# EAGLE design pcie_board (EAGLE 6.1)

## Sheet 1 of 2
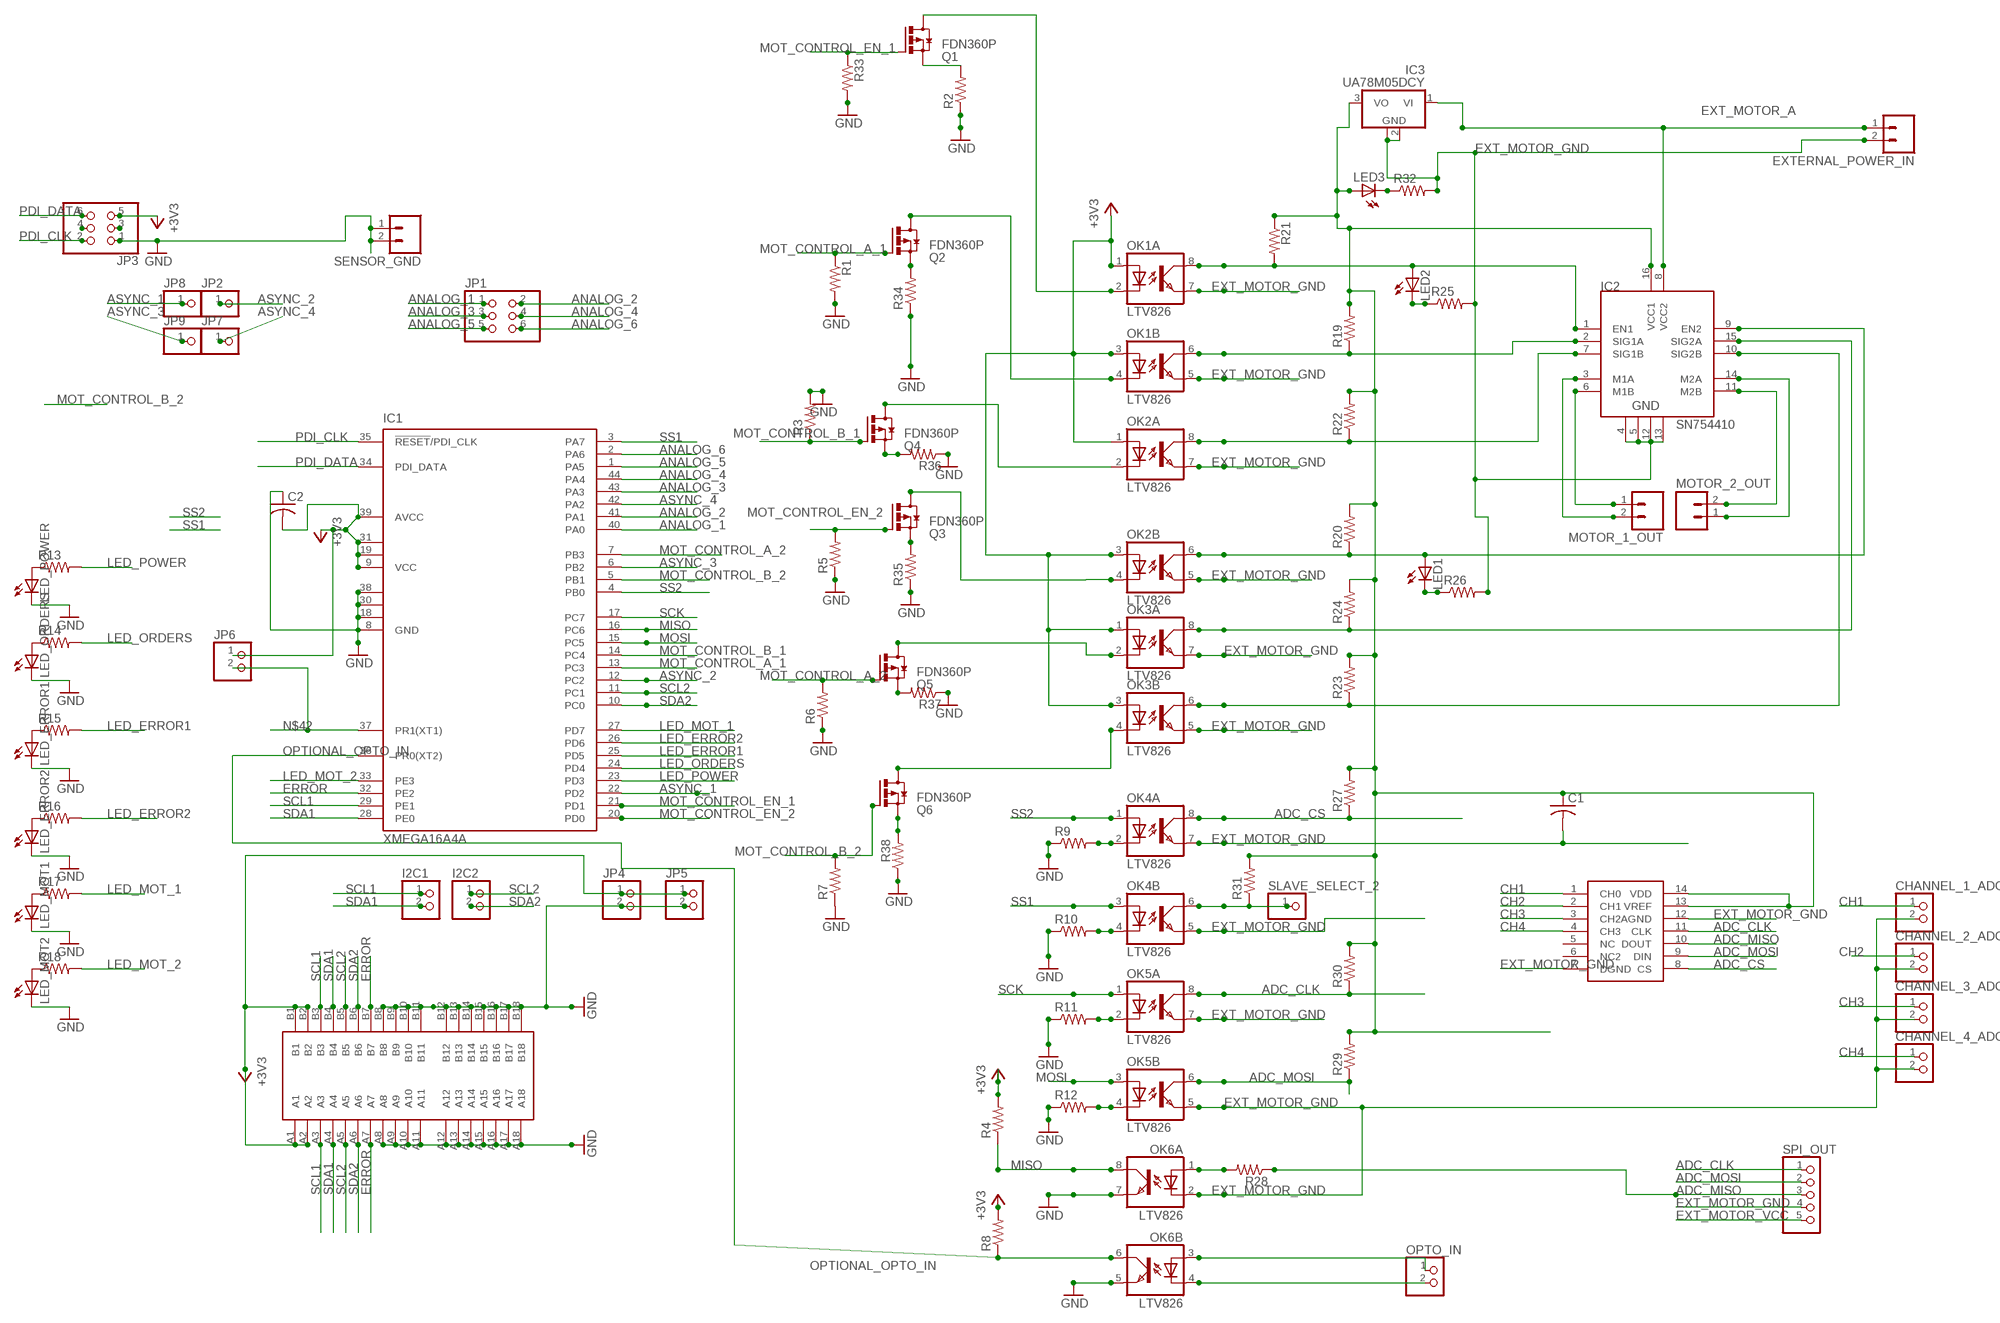
[diagram p0: schematic, sheet 1]

### Parts
C1  C-US025-040X050  [C025-040X050]
C2  C-US025-040X050  [C025-040X050]
CHANNEL_1_ADC  PINHD-1X2  [1X02]
CHANNEL_2_ADC  PINHD-1X2  [1X02]
CHANNEL_3_ADC  PINHD-1X2  [1X02]
CHANNEL_4_ADC  PINHD-1X2  [1X02]
EXTERNAL_POWER_IN  M023.5MM  [SCREWTERMINAL-3.5MM-2]
I2C1  PINHD-1X2  [1X02]
I2C2  PINHD-1X2  [1X02]
IC1  XMEGA16A4A  [TQFP44]
IC2  SN754410  [DIP16]
IC3  UA78M05DCY  [SOT223]
JP1  PINHD-2X3  [2X03]
JP2  PINHD-1X1  [1X01]
JP3  PINHD-2X3  [2X03]
JP4  PINHD-1X2  [1X02]
JP5  PINHD-1X2  [1X02]
JP6  PINHD-1X2  [1X02]
JP7  PINHD-1X1  [1X01]
JP8  PINHD-1X1  [1X01]
JP9  PINHD-1X1  [1X01]
LED1  LEDCHIP-LED0603  [CHIP-LED0603]
LED2  LEDCHIP-LED0603  [CHIP-LED0603]
LED3  LEDCHIP-LED0603  [CHIP-LED0603]
LED_ERROR1  LED5MM  [LED5MM]
LED_ERROR2  LED5MM  [LED5MM]
LED_MOT1  LED5MM  [LED5MM]
LED_MOT2  LED5MM  [LED5MM]
LED_ORDERS  LED5MM  [LED5MM]
LED_POWER  LED5MM  [LED5MM]
MOTOR_1_OUT  M023.5MM  [SCREWTERMINAL-3.5MM-2]
MOTOR_2_OUT  M023.5MM  [SCREWTERMINAL-3.5MM-2]
OK1  LTV826  [DIL08]
OK2  LTV826  [DIL08]
OK3  LTV826  [DIL08]
OK4  LTV826  [DIL08]
OK5  LTV826  [DIL08]
OK6  LTV826  [DIL08]
OPTO_IN  PINHD-1X2  [1X02]
Q1  FDN360P  [SUPER-SOT3]
Q2  FDN360P  [SUPER-SOT3]
Q3  FDN360P  [SUPER-SOT3]
Q4  FDN360P  [SUPER-SOT3]
Q5  FDN360P  [SUPER-SOT3]
Q6  FDN360P  [SUPER-SOT3]
R1  R-US_M0805  [M0805]
R2  R-US_M0805  [M0805]
R3  R-US_M0805  [M0805]
R4  R-US_M0805  [M0805]
R5  R-US_M0805  [M0805]
R6  R-US_M0805  [M0805]
R7  R-US_M0805  [M0805]
R8  R-US_M0805  [M0805]
R9  R-US_M0805  [M0805]
R10  R-US_M0805  [M0805]
R11  R-US_M0805  [M0805]
R12  R-US_M0805  [M0805]
R13  R-US_M0805  [M0805]
R14  R-US_M0805  [M0805]
R15  R-US_M0805  [M0805]
R16  R-US_M0805  [M0805]
R17  R-US_M0805  [M0805]
R18  R-US_M0805  [M0805]
R19  R-US_M0805  [M0805]
R20  R-US_M0805  [M0805]
R21  R-US_M0805  [M0805]
R22  R-US_M0805  [M0805]
R23  R-US_M0805  [M0805]
R24  R-US_M0805  [M0805]
R25  R-US_M0805  [M0805]
R26  R-US_M0805  [M0805]
R27  R-US_M0805  [M0805]
R28  R-US_M0805  [M0805]
R29  R-US_M0805  [M0805]
R30  R-US_M0805  [M0805]
R31  R-US_M0805  [M0805]
R32  R-US_M0805  [M0805]
R33  R-US_M0805  [M0805]
R34  R-US_M0805  [M0805]
R35  R-US_M0805  [M0805]
R36  R-US_M0805  [M0805]
R37  R-US_M0805  [M0805]
R38  R-US_M0805  [M0805]
SENSOR_GND  M023.5MM  [SCREWTERMINAL-3.5MM-2]
SLAVE_SELECT_2  PINHD-1X1  [1X01]
SPI_OUT  PINHD-1X5  [1X05]
U$1  PCI-E1X_EDGE  [PCI-E_X1_EDGE]
U$2  MCP3004  [DIL14]

### Nets
+3V3: C2.2 IC1.9(VCC) IC1.19(VCC1) IC1.31(VCC2) IC1.39(AVCC) JP3.5 JP4.1 JP5.1 JP6.1 OK1.1(A:A) OK1.3(B:A) OK2.1(A:A) OK2.3(B:A) OK3.1(A:A) OK3.3(B:A) R4.2 R8.2 U$1.A1 U$1.A2 U$1.B1 U$1.B2
ADC_CLK: OK5.8(A:COL) R30.1 SPI_OUT.1 U$2.11(CLK)
ADC_CS: OK4.8(A:COL) R27.1 U$2.8(CS)
ADC_MISO: R28.1 SPI_OUT.3 U$2.10(DOUT)
ADC_MOSI: OK5.6(B:COL) R29.1 SPI_OUT.2 U$2.9(DIN)
ANALOG_1: IC1.40(PA0) JP1.1
ANALOG_2: IC1.41(PA1) JP1.2
ANALOG_3: IC1.43(PA3) JP1.3
ANALOG_4: IC1.44(PA4) JP1.4
ANALOG_5: IC1.1(PA5) JP1.5
ANALOG_6: IC1.2(PA6) JP1.6
ASYNC_1: IC1.22(PD2) JP8.1
ASYNC_2: IC1.12(PC2) JP2.1
ASYNC_3: IC1.6(PB2) JP9.1
ASYNC_4: IC1.42(PA2) JP7.1
CH1: CHANNEL_1_ADC.1 U$2.1(CH0)
CH2: CHANNEL_2_ADC.1 U$2.2(CH1)
CH3: CHANNEL_3_ADC.1 U$2.3(CH2)
CH4: CHANNEL_4_ADC.1 U$2.4(CH3)
ERROR: IC1.32(PE2) U$1.A7 U$1.B7
EXT_MOTOR_A [POWER]: EXTERNAL_POWER_IN.1 IC2.8(VCC2) IC3.1(VI)
EXT_MOTOR_GND [clearance]: C1.2 CHANNEL_1_ADC.2 CHANNEL_2_ADC.2 CHANNEL_3_ADC.2 CHANNEL_4_ADC.2 EXTERNAL_POWER_IN.2 IC2.4 IC2.5 IC2.12 IC2.13 IC3.2(GND) IC3.4(GND) OK1.5(B:EMIT) OK1.7(A:EMIT) OK2.5(B:EMIT) OK2.7(A:EMIT) OK3.5(B:EMIT) OK3.7(A:EMIT) OK4.5(B:EMIT) OK4.7(A:EMIT) OK5.5(B:EMIT) OK5.7(A:EMIT) OK6.2(A:C) R25.2 R26.2 R32.2 SPI_OUT.4 U$2.7(DGND) U$2.12(AGND)
EXT_MOTOR_VCC: C1.1 IC2.16(VCC1) IC3.3(VO) LED3.A R19.2 R20.2 R21.1 R22.2 R23.2 R24.2 R27.2 R29.2 R30.2 R31.2 SPI_OUT.5 U$2.13(VREF) U$2.14(VDD)
GND: C2.1 IC1.8(GND) IC1.18(GND1) IC1.30(GND2) IC1.38(GND3) JP3.1 JP4.2 JP5.2 LED_ERROR1.K(C) LED_ERROR2.K(C) LED_MOT1.K(C) LED_MOT2.K(C) LED_ORDERS.K(C) LED_POWER.K(C) OK6.5(B:EMIT) OK6.7(A:EMIT) R1.2 R2.1 R3.2 R5.1 R6.1 R7.1 R9.1 R10.1 R11.1 R12.1 R33.2 R34.1 R35.1 R36.1 R37.1 R38.1 SENSOR_GND.1 SENSOR_GND.2 U$1.A8 U$1.A9 U$1.A10 U$1.A11 U$1.A12 U$1.A13 U$1.A14 U$1.A15 U$1.A16 U$1.A17 U$1.A18 U$1.B8 U$1.B9 U$1.B10 U$1.B11 U$1.B12 U$1.B13 U$1.B14 U$1.B15 U$1.B16 U$1.B17 U$1.B18
LED_ERROR1: IC1.25(PD5) R15.2
LED_ERROR2: IC1.26(PD6) R16.2
LED_MOT_1: IC1.27(PD7) R17.2
LED_MOT_2: IC1.33(PE3) R18.2
LED_ORDERS: IC1.24(PD4) R14.2
LED_POWER: IC1.23(PD3) R13.2
MISO: IC1.16(PC6) OK6.8(A:COL) R4.1
MOSI: IC1.15(PC5) OK5.3(B:A)
MOT_CONTROL_A_1: IC1.13(PC3) Q2.1(G) R1.1
MOT_CONTROL_A_2: IC1.7(PB3) Q5.1(G) R6.2
MOT_CONTROL_B_1: IC1.14(PC4) Q4.1(G) R3.1
MOT_CONTROL_B_2: IC1.5(PB1) Q6.1(G) R7.2
MOT_CONTROL_EN_1: IC1.21(PD1) Q1.1(G) R33.1
MOT_CONTROL_EN_2: IC1.20(PD0) Q3.1(G) R5.2
N$1: IC2.14(M2A) MOTOR_2_OUT.1
N$2: Q1.2(S) R2.2
N$3: IC2.11(M2B) MOTOR_2_OUT.2
N$4: OK1.2(A:C) Q1.3(D)
N$5: Q2.2(S) R34.2
N$6: OK1.4(B:C) Q2.3(D)
N$7: Q4.2(S) R36.2
N$8: OK4.2(A:C) R9.2
N$9: OK2.4(B:C) Q3.3(D)
N$10: OK3.2(A:C) Q5.3(D)
N$11: Q5.2(S) R37.2
N$12: OK4.4(B:C) R10.2
N$13: OK5.2(A:C) R11.2
N$14: OK5.4(B:C) R12.2
N$15: Q3.2(S) R35.2
N$16: LED_POWER.A R13.1
N$17: LED_ORDERS.A R14.1
N$18: OK2.2(A:C) Q4.3(D)
N$19: OK4.6(B:COL) R31.1 SLAVE_SELECT_2.1
N$20: LED_ERROR1.A R15.1
N$21: LED_ERROR2.A R16.1
N$22: LED_MOT1.A R17.1
N$23: LED_MOT2.A R18.1
N$24: IC2.1(EN1) LED2.A OK1.8(A:COL) R21.2
N$25: IC2.2(SIG1A) OK1.6(B:COL) R19.1
N$26: LED2.C R25.1
N$27: LED1.C R26.1
N$28: IC2.9(EN2) LED1.A OK2.6(B:COL) R20.1
N$29: IC2.7(SIG1B) OK2.8(A:COL) R22.1
N$30: IC2.15(SIG2A) OK3.8(A:COL) R24.1
N$31 [POWER]: IC2.3(M1A) MOTOR_1_OUT.2
N$32 [POWER]: IC2.6(M1B) MOTOR_1_OUT.1
N$33: IC2.10(SIG2B) OK3.6(B:COL) R23.1
N$34: OK6.1(A:A) R28.2
N$35: OK6.3(B:A) OPTO_IN.1
N$36: OK6.4(B:C) OPTO_IN.2
N$37: LED3.C R32.1
N$38: Q6.2(S) R38.2
N$39: JP3.4
N$40: JP3.3
N$41: OK3.4(B:C) Q6.3(D)
N$42: IC1.37(PR1(XT1)) JP6.2
OPTIONAL_OPTO_IN: IC1.36(PR0(XT2)) OK6.6(B:COL) R8.1
PDI_CLK: IC1.35(!RESET!/PDI_CLK) JP3.2
PDI_DATA: IC1.34(PDI_DATA) JP3.6
SCK: IC1.17(PC7) OK5.1(A:A)
SCL1: I2C1.1 IC1.29(PE1) U$1.A3 U$1.B3
SCL2: I2C2.1 IC1.11(PC1) U$1.A5 U$1.B5
SDA1: I2C1.2 IC1.28(PE0) U$1.A4 U$1.B4
SDA2: I2C2.2 IC1.10(PC0) U$1.A6 U$1.B6
SS1: IC1.3(PA7) OK4.3(B:A)
SS2: IC1.4(PB0) OK4.1(A:A)
Unconnected: U$2.5(NC) U$2.6(NC2)

## Sheet 2 of 2

## Library data of the parts
C1 C2 = resistor:C-US: CAPACITOR, American symbol
CHANNEL_1_ADC CHANNEL_2_ADC CHANNEL_3_ADC CHANNEL_4_ADC I2C1 I2C2 JP4-JP6 OPTO_IN = pinhead:PINHD-1X2: PIN HEADER
EXTERNAL_POWER_IN MOTOR_1_OUT MOTOR_2_OUT SENSOR_GND = SparkFun:M02: Header 2 Standard 2-pin 0.1" header. Use with straight break away headers (SKU : PRT-00116), right angle break away headers (PRT-00553), swiss pins (PRT-00743), machine pins (PRT-00117), and female headers (PRT-00115). Molex polarized connector foot print use with SKU : PRT-08233 with associated crimp pins and housings.
IC1 = atmel:XMEGA16A4: MICROCONTROLLER Features High-performance, Low-power 8/16-bit AVR XMEGA Microcontroller Non-Volatile Program and Data Memories - 16 KB - 128 KB of In-System Self-Programmable Flash - 4 KB - 8 KB Boot Code Section with Independent Lock Bits - 1 KB - 2 KB EEPROM - 2 KB - 8 KB Internal SRAM Peripheral Features - Four-channel DMA Controller with support for external requests - Eight-channel Event System - Five 16-bit Timer/Counters Three Timer/Counters with 4 Output Compare or Input Capture channels Two Timer/Counters with 2 Output Compare or Input Capture channels High-Resolution Extensions on all Timer/Counters Advanced Waveform Extension on one Timer/Counter - Five USARTs IrDA Extension on one USART - Two Two-Wire Interfaces with dual address match (I2C and SMBus compatible) - Two SPIs (Serial Peripheral Interfaces) peripherals - AES and DES Crypto Engine - 16-bit Real Time Counter with Separate Oscillator - One Twelve-channel, 12-bit, 2 Msps Analog to Digital Converter - One Two-channel, 12-bit, 1 Msps Digital to Analog Converter - Two Analog Comparators with Window compare function - External Interrupts on all General Purpose I/O pins - Programmable Watchdog Timer with Separate On-chip Ultra Low Power Oscillator Special Microcontroller Features - Power-on Reset and Programmable Brown-out Detection - Internal and External Clock Options with PLL - Programmable Multi-level Interrupt Controller - Sleep Modes: Idle, Power-down, Standby, Power-save, Extended Standby - Advanced Programming, Test and Debugging Interfaces PDI (Program and Debug Interface) for programming, test and debugging I/O and Packages - 34 Programmable I/O Lines - 44 - lead TQFP - 44 - pad VQFN/QFN - 49 - ball VFBGA Operating Voltage - 1.6 - 3.6V Speed performance - 0 - 12 MHz @ 1.6 - 3.6V - 0 - 32 MHz @ 2.7 - 3.6V Drawn by Dipl.-Ing. (FH) Robert Siegler Created: 27.05.09; OC_FARNELL: unknown; OC_NEWARK: unknown
IC2 = HBridge:SN754410: Quadruple half-H driver
IC3 = linear:UA78M*: POSITIVE-VOLTAGE REGULATORS Source: http://focus.ti.com/lit/ds/symlink/ua78m33.pdf
JP1 JP3 = pinhead:PINHD-2X3: PIN HEADER
JP2 JP7-JP9 SLAVE_SELECT_2 = pinhead:PINHD-1X1: PIN HEADER
LED1-LED3 LED_ERROR1 LED_ERROR2 LED_MOT1 LED_MOT2 LED_ORDERS LED_POWER = led:LED: LED OSRAM: - CHIPLED LG R971, LG N971, LY N971, LG Q971, LY Q971, LO R971, LY R971 LH N974, LH R974 LS Q976, LO Q976, LY Q976 LO Q996 - Hyper CHIPLED LW Q18S LB Q993, LB Q99A, LB R99A - SideLED LS A670, LO A670, LY A670, LG A670, LP A670 LB A673, LV A673, LT A673, LW A673 LH A674 LY A675 LS A676, LA A676, LO A676, LY A676, LW A676 LS A679, LY A679, LG A679 - Hyper Micro SIDELED® LS Y876, LA Y876, LO Y876, LY Y876 LT Y87S - SmartLED LW L88C, LW L88S LB L89C, LB L89S, LG L890 LS L89K, LO L89K, LY L89K LS L896, LA L896, LO L896, LY L896 - TOPLED LS T670, LO T670, LY T670, LG T670, LP T670 LSG T670, LSP T670, LSY T670, LOP T670, LYG T670 LG T671, LOG T671, LSG T671 LB T673, LV T673, LT T673, LW T673 LH T674 LS T676, LA T676, LO T676, LY T676, LB T676, LH T676, LSB T676, LW T676 LB T67C, LV T67C, LT T67C, LS T67K, LO T67K, LY T67K, LW E67C LS E67B, LA E67B, LO E67B, LY E67B, LB E67C, LV E67C, LT E67C LW T67C LS T679, LY T679, LG T679 LS T770, LO T770, LY T770, LG T770, LP T770 LB T773, LV T773, LT T773, LW T773 LH T774 LS E675, LA E675, LY E675, LS T675 LS T776, LA T776, LO T776, LY T776, LB T776 LHGB T686 LT T68C, LB T68C - Hyper Mini TOPLED® LB M676 - Mini TOPLED Santana® LG M470 LS M47K, LO M47K, LY M47K Source: http://www.osram.convergy.de LUXEON: - LUMILED® LXK2-PW12-R00, LXK2-PW12-S00, LXK2-PW14-U00, LXK2-PW14-V00 LXK2-PM12-R00, LXK2-PM12-S00, LXK2-PM14-U00 LXK2-PE12-Q00, LXK2-PE12-R00, LXK2-PE12-S00, LXK2-PE14-T00, LXK2-PE14-U00 LXK2-PB12-K00, LXK2-PB12-L00, LXK2-PB12-M00, LXK2-PB14-N00, LXK2-PB14-P00, LXK2-PB14-Q00 LXK2-PR12-L00, LXK2-PR12-M00, LXK2-PR14-Q00, LXK2-PR14-R00 LXK2-PD12-Q00, LXK2-PD12-R00, LXK2-PD12-S00 LXK2-PH12-R00, LXK2-PH12-S00 LXK2-PL12-P00, LXK2-PL12-Q00, LXK2-PL12-R00 Source: www.luxeon.com KINGBRIGHT: KA-3528ASYC Source: www.kingbright.com
OK1-OK6 = optocoupler:LTV826: OPTO COUPLER Source: LITEON, LTV816.pdf; OC_FARNELL: unknown; OC_NEWARK: unknown
Q1-Q6 = transistor-power:FDN360P: Single P-Channel, PowerTrench (R) MOSFET Source: http://www.fairchildsemi.com/ds/FD/FDN360P.pdf
R1-R38 = resistor:R-US_: RESISTOR, American symbol
SPI_OUT = pinhead:PINHD-1X5: PIN HEADER
U$1 = con-pci_express(pci-e):PCI-E1X_EDGE
U$2 = microchip:MCP3004

## Net classes
0 default: width 0.203 mm, clearance 0.203 mm
1 POWER: width 0.813 mm, clearance 0.203 mm
2 clearance: width 0.203 mm, clearance 0.203 mm

## Board
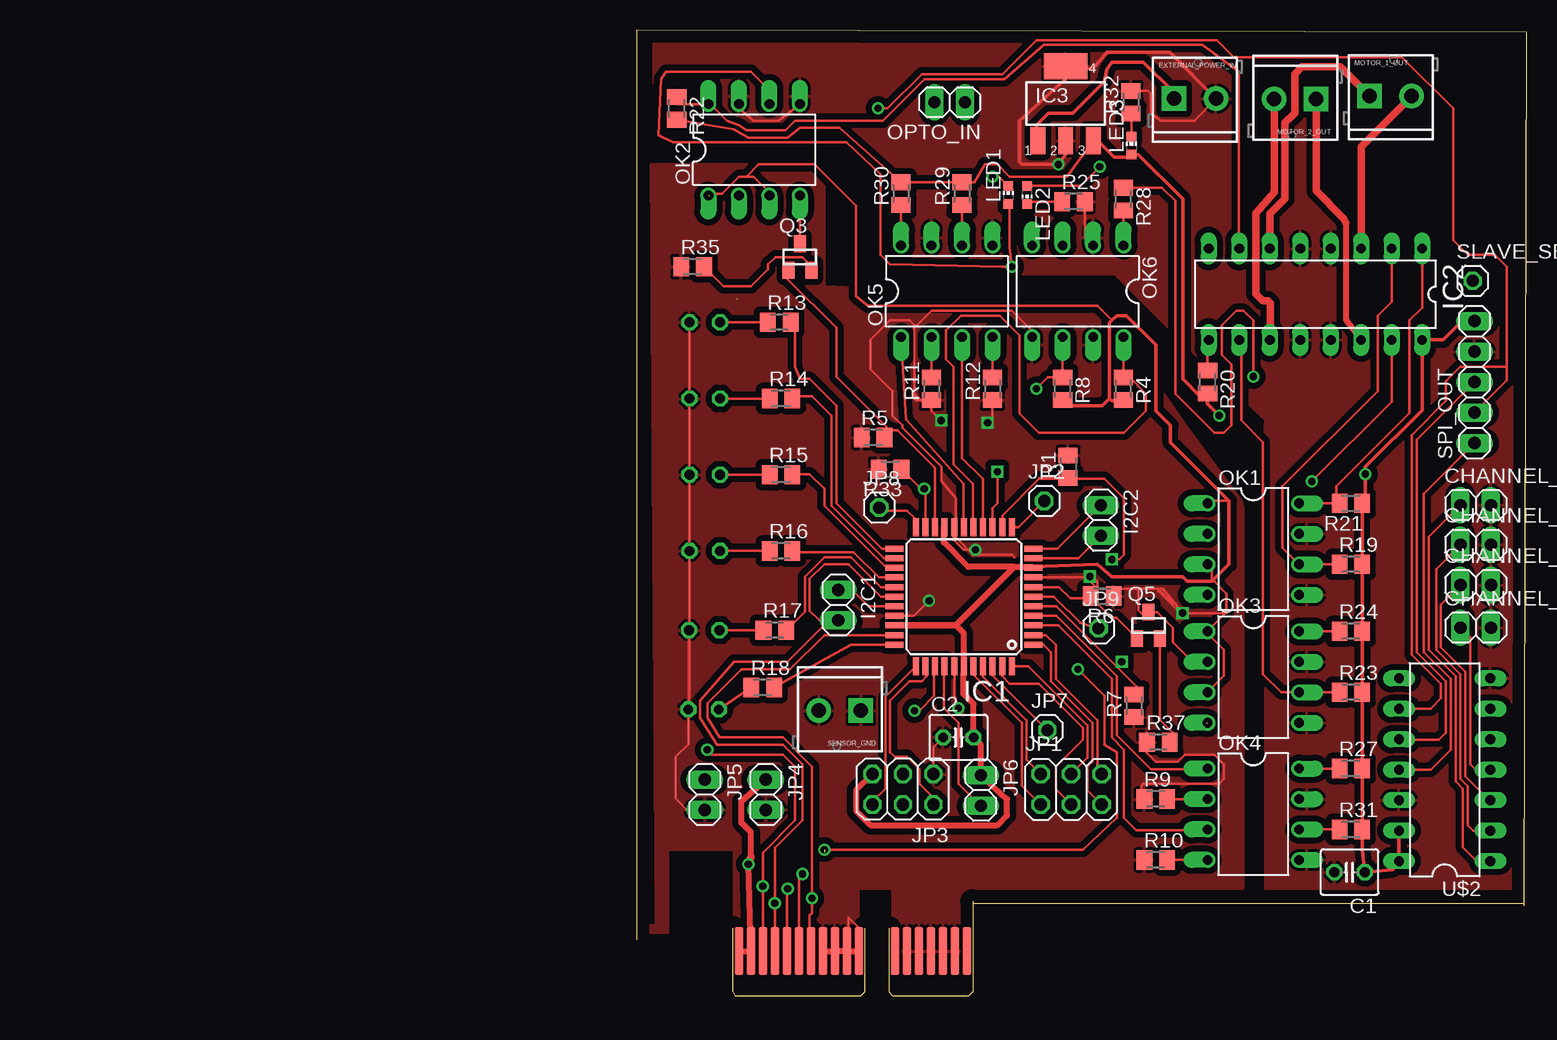
[diagram p1: board, top side]
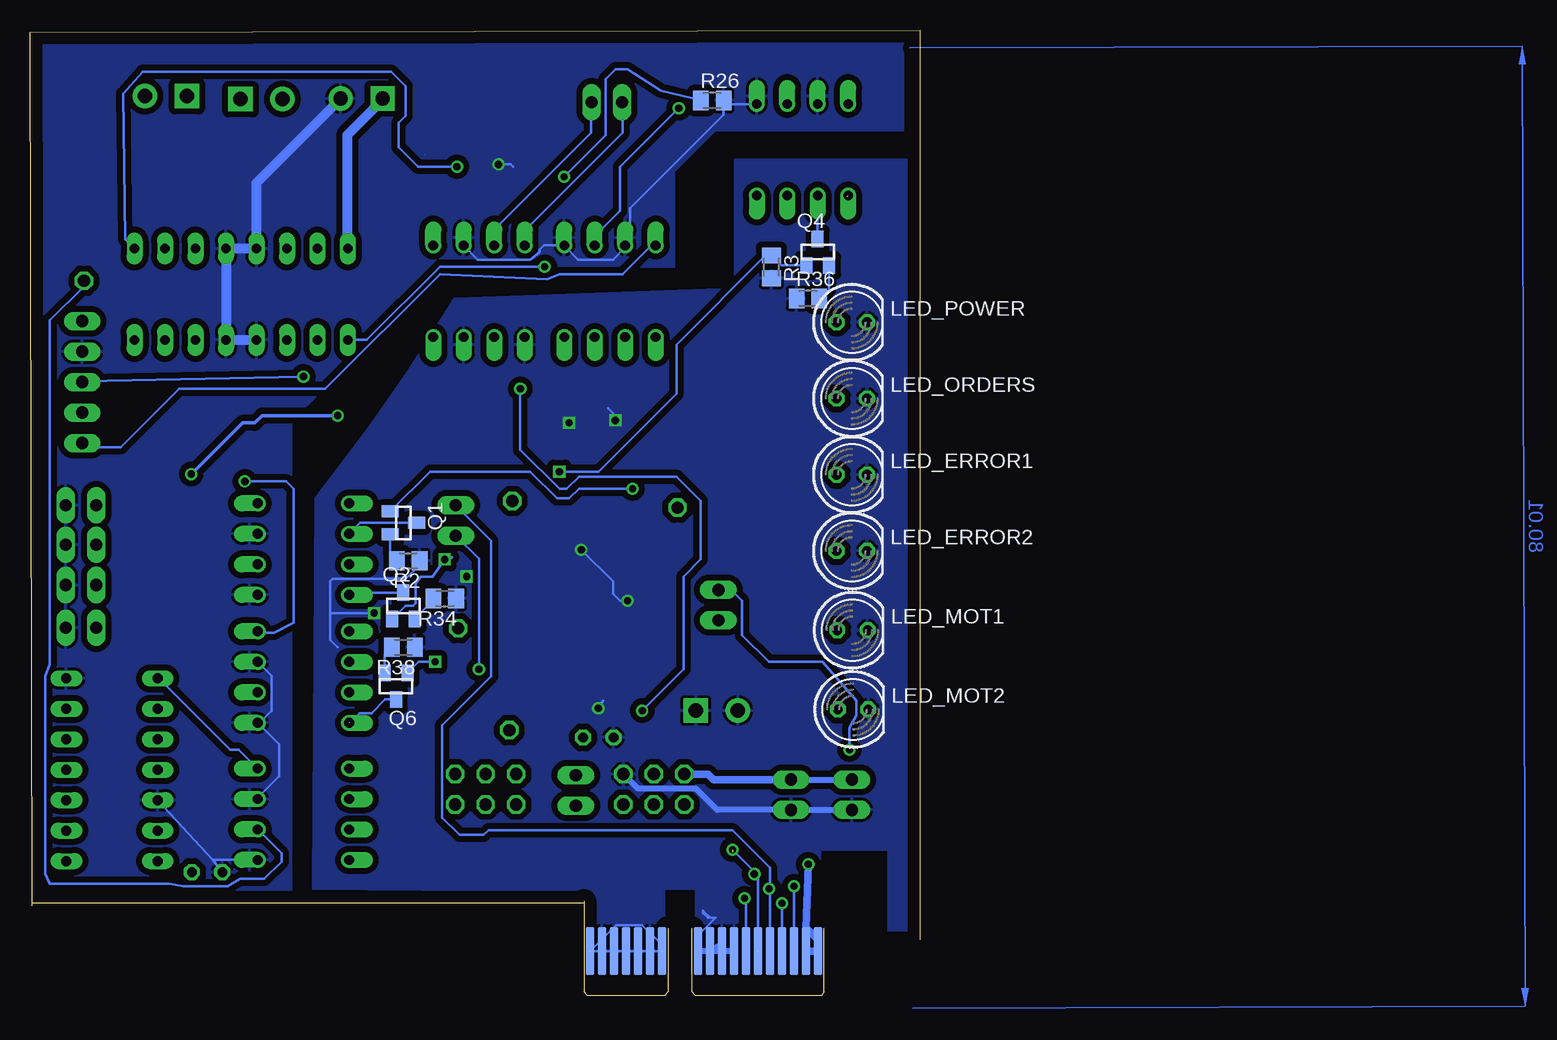
[diagram p2: board, bottom side, seen from below]

Size 74.2 x 80.46 mm. Coordinates in mm from the lower left corner, seen from the top.
Outline: 74,7.48 74.2,80.26 0,80.46 0,4.64
Outline: 28.04,7.69 73.96,7.69
Copper layers (1*16): Top 0.035mm / dielectric 1.5mm / Bottom 0.035mm
Design rules: minimum track width 8mil, minimum drill 24mil, track to track 8mil, track to pad 8mil, pad to pad 8mil, via to via 8mil, smd to smd 8mil, copper to edge 40mil, drill to drill 8mil, minimum pad ring 10mil, minimum via ring 8mil, stop-mask expansion 4mil, vias tented up to drill 0mil, thermal gap 10mil

### Footprints (pad centres in the part's own frame; a part is rotated, then mirrored left to right if it is on the bottom)
C025-040X050 = drill 0.813 octagon: 1 -1.27,0; 2 1.27,0
1X02 = drill 1.016 long: 1 -1.27,0; 2 1.27,0
SCREWTERMINAL-3.5MM-2 = drill 1.2 pad 2.032 square: 1 0,0 | drill 1.2 pad 2.032: 2 3.5,0
TQFP44 = smd 1.5 x 0.5: 1 -5.8,4; 2 -5.8,3.2; 3 -5.8,2.4; 4 -5.8,1.6; 5 -5.8,0.8; 6 -5.8,0; 7 -5.8,-0.8; 8 -5.8,-1.6; 9 -5.8,-2.4; 10 -5.8,-3.2; 11 -5.8,-4; 23 5.8,-4; 24 5.8,-3.2; 25 5.8,-2.4; 26 5.8,-1.6; 27 5.8,-0.8; 28 5.8,0; 29 5.8,0.8; 30 5.8,1.6; 31 5.8,2.4; 32 5.8,3.2; 33 5.8,4 | smd 0.5 x 1.5: 12 -4,-5.8; 13 -3.2,-5.8; 14 -2.4,-5.8; 15 -1.6,-5.8; 16 -0.8,-5.8; 17 0,-5.8; 18 0.8,-5.8; 19 1.6,-5.8; 20 2.4,-5.8; 21 3.2,-5.8; 22 4,-5.8; 34 4,5.8; 35 3.2,5.8; 36 2.4,5.8; 37 1.6,5.8; 38 0.8,5.8; 39 0,5.8; 40 -0.8,5.8; 41 -1.6,5.8; 42 -2.4,5.8; 43 -3.2,5.8; 44 -4,5.8
DIP16 = drill 0.813 long: 1 -10.16,-3.81; 2 -7.62,-3.81; 3 -5.08,-3.81; 4 -2.54,-3.81; 5 0,-3.81; 6 2.54,-3.81; 7 5.08,-3.81; 8 7.62,-3.81; 9 7.62,3.81; 10 5.08,3.81; 11 2.54,3.81; 12 0,3.81; 13 -2.54,3.81; 14 -5.08,3.81; 15 -7.62,3.81; 16 -10.16,3.81
SOT223 = smd 1.219 x 2.235: 1 -2.311,-3.099; 2 0,-3.099; 3 2.311,-3.099 | smd 3.6 x 2.2: 4 0,3.099
2X03 = drill 1.016 octagon: 1 -2.54,-1.27; 2 -2.54,1.27; 3 0,-1.27; 4 0,1.27; 5 2.54,-1.27; 6 2.54,1.27
1X01 = drill 1.016 octagon: 1 0,0
CHIP-LED0603 = smd 0.8 x 0.8: A 0,-0.75; C 0,0.75
LED5MM = drill 0.813 octagon: A -1.27,0; K 1.27,0
DIL08 = drill 0.813 offset: 1 -3.81,-3.81; 2 -1.27,-3.81; 3 1.27,-3.81; 4 3.81,-3.81; 5 3.81,3.81; 6 1.27,3.81; 7 -1.27,3.81; 8 -3.81,3.81
SUPER-SOT3 = smd 1 x 1.4: 1 -0.95,-1.1; 2 0.95,-1.1; 3 0,1.1
M0805 = smd 1.3 x 1.6: 1 -0.95,0; 2 0.95,0
1X05 = drill 1.016 long: 1 -5.08,0; 2 -2.54,0; 3 0,0; 4 2.54,0; 5 5.08,0
PCI-E_X1_EDGE = smd 0.7 x 4 bottom: A1 -11.14,-1.6; A2 -10.14,-1.6; A3 -9.14,-1.6; A4 -8.14,-1.6; A5 -7.14,-1.6; A6 -6.14,-1.6; A7 -5.14,-1.6; A8 -4.14,-1.6; A9 -3.14,-1.6; A10 -2.14,-1.6; A11 -1.14,-1.6; A12 1.86,-1.6; A13 2.86,-1.6; A14 3.86,-1.6; A15 4.86,-1.6; A16 5.86,-1.6; A17 6.86,-1.6; A18 7.86,-1.6 | smd 0.7 x 4: B1 -11.14,-1.6; B2 -10.14,-1.6; B3 -9.14,-1.6; B4 -8.14,-1.6; B5 -7.14,-1.6; B6 -6.14,-1.6; B7 -5.14,-1.6; B8 -4.14,-1.6; B9 -3.14,-1.6; B10 -2.14,-1.6; B11 -1.14,-1.6; B12 1.86,-1.6; B13 2.86,-1.6; B14 3.86,-1.6; B15 4.86,-1.6; B16 5.86,-1.6; B17 6.86,-1.6; B18 7.86,-1.6
DIL14 = drill 0.813 long: 1 -7.62,-3.81; 2 -5.08,-3.81; 3 -2.54,-3.81; 4 0,-3.81; 5 2.54,-3.81; 6 5.08,-3.81; 7 7.62,-3.81; 8 7.62,3.81; 9 5.08,3.81; 10 2.54,3.81; 11 0,3.81; 12 -2.54,3.81; 13 -5.08,3.81; 14 -7.62,3.81

### Placement (x,y rotation side)
C1  59.44,10.28 180 top
C2  26.82,21.51 0 top
CHANNEL_1_ADC  69.95,40.86 0 top
CHANNEL_2_ADC  69.95,37.56 0 top
CHANNEL_3_ADC  69.95,34.21 0 top
CHANNEL_4_ADC  69.95,30.65 0 top
EXTERNAL_POWER_IN  44.81,74.74 0 top
I2C1  16.81,32.53 270 top
I2C2  38.71,39.59 270 top
IC1  27.28,33.24 180 top
IC2  55.32,58.44 180 top
IC3  35.76,74.34 0 top
JP1  36.22,17.19 0 top
JP2  33.99,41.22 0 top
JP3  22.2,17.19 180 top
JP4  10.77,16.73 270 top
JP5  5.69,16.73 270 top
JP6  28.7,17.09 270 top
JP7  34.24,22.11 0 top
JP8  20.22,40.66 0 top
JP9  38.51,30.6 0 top
LED1  30.99,66.72 0 top
LED2  32.56,66.72 180 top
LED3  41.25,70.83 0 top
LED_ERROR1  5.69,43.4 0 bottom
LED_ERROR2  5.69,37.05 0 bottom
LED_MOT1  5.64,30.45 0 bottom
LED_MOT2  5.59,23.84 0 bottom
LED_ORDERS  5.69,49.75 0 bottom
LED_POWER  5.69,56.1 0 bottom
MOTOR_1_OUT  61.11,74.95 0 top
MOTOR_2_OUT  56.64,74.69 180 top
OK1  51.41,37.2 270 top
OK2  9.8,70.48 0 top
OK3  51.41,26.53 270 top
OK4  51.41,15.1 270 top
OK5  25.86,58.69 0 top
OK6  36.78,58.69 180 top
OPTO_IN  26.11,74.44 180 top
Q1  43.08,39.39 270 bottom
Q2  43.08,32.48 0 bottom
Q3  13.61,61.54 0 top
Q4  8.53,61.94 0 bottom
Q5  42.67,30.85 0 top
Q6  43.69,25.77 180 bottom
R1  35.97,44.06 90 top
R2  42.67,36.24 180 bottom
R3  12.4,60.72 270 bottom
R4  40.59,50.56 270 top
R5  19.71,46.5 0 top
R6  38.81,33.29 180 top
R7  41.45,24.15 90 top
R8  35.51,50.56 270 top
R9  43.28,16.37 0 top
R10  43.28,11.29 0 top
R11  24.59,50.56 90 top
R12  29.67,50.56 90 top
R13  11.89,56.1 0 top
R14  12.04,49.75 0 top
R15  12.04,43.4 0 top
R16  12.04,37.05 0 top
R17  11.53,30.45 0 top
R18  10.52,25.67 0 top
R19  59.54,35.93 0 top
R20  47.6,51.12 270 top
R21  59.54,41.01 180 top
R22  3.35,73.93 270 top
R23  59.54,25.26 0 top
R24  59.54,30.34 0 top
R25  36.42,66.16 0 top
R26  17.32,74.59 0 bottom
R27  59.54,18.91 0 top
R28  40.59,66.36 270 top
R29  27.13,66.82 90 top
R30  22.05,66.82 90 top
R31  59.54,13.83 0 top
R32  41.2,74.44 90 top
R33  21.13,43.86 180 top
R34  39.62,33.09 180 bottom
R35  4.67,60.72 0 top
R36  9.35,58.08 0 bottom
R37  43.48,21.1 0 top
R38  43.08,29.02 180 bottom
SENSOR_GND  18.69,23.74 180 top
SLAVE_SELECT_2  69.7,59.55 0 top
SPI_OUT  69.85,51.12 90 top
U$1  19.66,5.3 0 top
U$2  67.36,18.81 90 top

### Tracks (layer width: path | path; a pad name or v marks a point on that pad's centre or on a via)
+3V3  (via drill 0.6)  (1 unrouted)
  Top 0.203: JP3.5 19.66,18.41 | 27.23,26.78 IC1.39 | 49.38,41.22 47.8,41.22 OK1.1 | OK1.3 47.96,35.58 47.96,34.51 48.16,34.51 49.17,33.49 49.17,31.92 OK3.1 47.6,30.19 48.97,28.82 48.97,26.64 OK3.3 47.85,25.26 | OK2.3 11.07,66.92 9.75,68.24 9.14,68.24 | 39.62,56.25 38.4,57.47 19.3,57.47 18.29,58.28 18.29,65.8 14.83,69.26 10.16,69.26 9.14,68.24 | 9.14,68.24 8.53,68.24 7.11,66.82 6.3,66.82 6.1,66.62
  Top 0.305: 32.99,35.73 38.4,35.93 39.62,34.92 45.52,34.92 45.92,34.51 47.96,34.51 49.38,35.93 49.38,41.22 44.5,46.09 44.5,47.52 43.28,48.73 43.28,54.22 40.84,56.66 40.03,56.66 39.62,56.25 39.42,56.05 39.42,49.75 | 39.42,49.75 39.62,49.55 40.52,49.55 R4.2 | 39.42,49.75 38.81,49.14 35.98,49.14 R8.2
  Top 0.508: U$1.A1 U$1.A2 v9.32,10.94 | 9.52,11.55 9.52,13.61 8.74,14.39 8.74,16.17 JP4.1 | 27.23,26.78 27.23,25.16 28.09,24.3 C2.2 28.7,20.9 JP6.1 30.89,16.37 30.89,15 30.07,14.19 19.51,14.19 18.29,15.41 18.29,17.09 JP3.5 | IC1.39 27.28,30.19 26.62,30.85 21.49,30.85 IC1.31 26.61,30.84 31.5,35.73 | 31.5,35.73 32.99,35.73 IC1.9 | 31.5,35.73 27.64,35.73 25.6,37.76 25.6,38.96 IC1.19
  Top 0.61: v9.32,10.94 9.52,11.55
  Bottom 0.508: JP4.1 JP5.1
  Bottom 0.61: U$1.A2 U$1.A1 8.52,4.66 9.52,5.66 v9.32,10.94 | JP4.1 17.22,18 17.68,18.46 JP3.5
ADC_CLK
  Top 0.203: OK5.8 R30.1 | SPI_OUT.1 65.63,41.83 65.63,28.62 67.87,26.38 67.87,20.49 66.19,18.81 U$2.11
  Bottom 0.203: OK5.8 22.4,62.5 24.79,60.11 30.07,60.11 31.09,59.71 40.03,60.11 49.58,50.56 61.77,50.56 66.65,45.69 69.49,45.69 SPI_OUT.1
ADC_CS
  Top 0.203: R27.1 OK4.8
  Bottom 0.203: U$2.8 63.45,26.43 57.51,20.49 56.79,20.49 OK4.8
ADC_MISO  (via drill 0.6)
  Top 0.203: R28.1 43.8,67.31 44.91,66.21 44.91,50.16 48.16,46.91 48.97,46.91 49.58,47.52 49.58,52.6 48.77,53.41 48.77,55.85 49.99,57.07 50.6,57.07 51.41,56.25 v51.41,51.58 | 64.67,21.35 U$2.10 63.6,21.3 66.85,21.3 67.46,21.91 67.46,26.18 65.02,28.62 65.02,46.3 SPI_OUT.3
  Bottom 0.203: v51.41,51.58 69.8,51.17 SPI_OUT.3
ADC_MOSI  (via drill 0.6)
  Top 0.203: OK5.6 R29.1 | 72.54,52.39 72.54,60.72 71.53,61.74 69.29,61.74 68.07,62.96 68.07,73.93 63.8,78.2 49.78,78.2 48.36,79.62 33.32,79.62 30.48,76.78 23.77,76.78 20.93,73.93 v20.12,73.93 | 72.54,52.39 72.54,51.27 SPI_OUT.2 | U$2.9 66.19,23.89 67.06,24.76 67.06,25.98 64.62,28.41 64.62,46.7 67.46,49.55 67.46,51.17 68.68,52.39 72.54,52.39
  Bottom 0.203: OK5.6 27.13,63.26 24.99,65.4 24.99,69.05 v20.12,73.93
ANALOG_1
  Top 0.203: IC1.40 28.08,26.75 32.11,22.72 32.11,17.49 JP1.1
ANALOG_2
  Top 0.203: IC1.41 28.88,26.56 32.51,22.93 32.51,19.63 JP1.2
ANALOG_3
  Top 0.203: IC1.43 30.48,26.59 31.09,25.98 33.53,25.98 37.19,22.32 37.19,21.3 34.95,19.07 34.95,17.19 JP1.3
ANALOG_4
  Top 0.203: IC1.44 32.67,27.44 37.59,22.52 37.59,19.83 JP1.4
ANALOG_5
  Top 0.203: IC1.1 33.92,29.24 34.54,28.62 34.54,26.18 38,22.72 38,19.47 37.59,19.07 37.59,17.09 JP1.5
ANALOG_6
  Top 0.203: IC1.2 34.14,30.04 34.95,29.23 34.95,26.38 38.4,22.93 38.4,18.81 JP1.6
ASYNC_1
  Top 0.203: IC1.22 23.28,39.68 22.56,40.4 20.47,40.4 JP8.1
ASYNC_2
  Top 0.203: IC1.12 31.81,39.04 JP2.1
ASYNC_3
  Top 0.203: IC1.6 34.8,33.24 36.98,31.06 38.25,30.65 JP9.1
ASYNC_4
  Top 0.203: IC1.42 29.68,26.67 JP7.1
CH1
  Top 0.203: U$2.1 70.05,11.19 68.88,12.36 68.88,17.24 68.28,17.85 68.28,26.59 66.04,28.82 66.04,38.22 CHANNEL_1_ADC.1
CH2
  Top 0.203: U$2.2 69.75,13.73 69.29,14.19 69.29,17.44 68.68,18.05 68.68,26.79 66.65,28.82 66.65,35.53 CHANNEL_2_ADC.1
CH3
  Top 0.203: U$2.3 71.07,16.27 69.09,18.25 69.09,26.99 67.06,29.02 67.06,32.58 CHANNEL_3_ADC.1
CH4
  Top 0.203: U$2.4 69.95,18.81 69.49,19.27 69.49,29.84 CHANNEL_4_ADC.1
ERROR  (via drill 0.6)
  Top 0.203: IC1.32 15.65,30.04 12.8,27.2 8.74,27.2 5.89,24.35 5.89,23.13 6.91,21.5 12.19,21.5 14.63,19.07 v14.63,8.09 14.63,6.88 14.43,6.67 14.43,3.79 U$1.A7
  Bottom 0.203: U$1.A7 14.52,7.98 v14.63,8.09
EXT_MOTOR_A
  Top 0.305: EXTERNAL_POWER_IN.1 44.81,75.25 42.27,77.79 39.62,77.79 39.22,77.18 39.01,76.17 36.37,73.52 34.34,73.52 33.32,72.51 33.32,71.16 IC3.1
  Bottom 0.813: EXTERNAL_POWER_IN.1 44.81,74.64 47.75,71.7 47.75,62.3 IC2.8
EXT_MOTOR_GND  (via drill 0.6)
  Top 0.203: 41.21,75.39 R32.2 42.64,75.39 42.88,75.15 42.88,73.52 43.69,72.92 46.48,72.92 | 46.48,72.92 EXTERNAL_POWER_IN.2 | OK2.7 8.53,73.93 9.75,72.92 11.84,72.92 OK2.5 | 46.48,72.92 46.53,72.92 | R25.2 37.37,63.18 OK6.2
  Top 0.305: EXTERNAL_POWER_IN.2 44.44,78.6 39.22,78.6 38.05,77.23 IC3.4 35.76,76.37 31.9,72.92 31.9,69.46 32.11,69.26 v35.15,69.26 35.76,70.07 IC3.2
  Bottom 0.203: OK2.5 16.07,74.29 R26.2 16.37,73.41 24.18,65.6 24.18,62.91 OK5.7 24.59,62.35 25.6,61.33 28.5,61.33 OK5.5 31.34,62.5 31.7,62.15 31.7,61.94 32.51,61.33 36.88,61.33 OK6.2 | C1.2 58.98,11.29 | 58.98,11.29 U$2.12 | 58.98,11.29 OK4.5 | OK4.7 55.22,16.48 53.44,18.25 53.44,20.95 OK3.5 55.07,22.72 54.05,23.74 54.05,26.64 OK3.7 | v35.15,69.26 34.14,69.26 33.93,69.05
  Bottom 0.813: IC2.12 IC2.13 IC2.4 IC2.5 55.32,67.73 EXTERNAL_POWER_IN.2
  pour Top (isolate 0.508): 1.42,71.09 17.07,71.09 17.07,60.11 39.83,60.11 47.35,52.59 52.43,47.92 52.02,42.43 52.43,42.43 52.43,8.91 73.96,8.91 74.37,80.23 1.42,80.23
  pour Bottom (isolate 0.508): 1.42,80.43 1.42,72.1 17.07,72.1 20.73,68.44 20.52,68.44 20.52,60.72 39.22,60.72 48.16,51.99 52.43,47.92 52.43,8.7 74.17,8.7 74.17,9.11 73.96,9.11 74.17,80.23
EXT_MOTOR_VCC  (via drill 0.6)  (1 unrouted)
  Top 0.203: R22.2 8.06,72.17 9.35,71.49 12.6,71.49 13.61,72.31 16.9,72.31 R30.2 R29.2 28.18,67.77 29.06,69.26 30.07,69.26 31.09,68.24 35.89,68.24 IC3.3
  Top 0.305: IC3.3 38.66,71.03 39.83,69.87 41.05,69.87 LED3.A | LED3.A 41.85,70.08 45.52,66.41 45.52,51.38 46.94,49.95 47.38,49.95 R20.2 47.6,49.29 v48.56,48.33 | 60.76,41.42 60.76,41.28 R21.1 | SPI_OUT.5 69.8,56.25 68.88,56.25 67.26,54.63 IC2.16 65.48,48.79 60.76,44.06 v60.76,43.45 60.76,41.42 | 60.76,41.42 60.49,41.15 R19.2 R24.2 R23.2 R27.2 R31.2 60.49,12.12 C1.1 63.04,10.48 U$2.14 U$2.13
  Bottom 0.305: v48.56,48.33 54.86,48.33 55.47,47.72 56.49,47.72 v60.76,43.45
GND  (via drill 0.6)  (3 unrouted)
  Top 0.203: 4.32,23.13 LED_MOT2.K 4.42,23.94 LED_ERROR2.K LED_ERROR1.K LED_ORDERS.K LED_POWER.K | 4.32,23.13 4.32,20.95 3.25,19.88 3.25,16.43 4.47,15.21 5.44,15.21 JP5.2 | LED_MOT1.K 4.37,23.18 4.32,23.13 | JP3.1 24.74,20.69 C2.1 | IC1.8 37.47,34.84 38.4,33.9 | 38.4,33.9 41.82,33.9 | 41.82,33.9 41.82,32.11 42.06,31.87 | IC1.38 26.48,25.02 v26.82,23.94 | IC1.30 23.14,31.64 v24.38,32.88 | v28.24,37.15 27.23,37.15 26.42,37.96 26.42,38.17 | 26.42,38.17 26.42,38.98 IC1.18 | U$1.A11 18.52,5.63 17.68,6.47 17.68,3.86 U$1.A10 | 38.4,33.9 38.4,34.51 v37.8,34.92 | OK6.5 32.97,55.39 31.29,57.07 24.59,57.07 23.16,55.64 23.16,50.16 23.77,49.55 24.52,49.55 R11.1 | R11.1 23.3,49.61 23.16,49.75 23.16,55.85 22.76,56.25 21.13,56.25 19.51,54.63 19.51,52.19 21.34,50.36 21.34,48.33 22.15,47.52 22.15,47.31 25.4,44.06 25.4,42.84 26.62,41.42 26.62,38.37 26.42,38.17 | 26.42,38.17 26.62,38.17 28.04,36.75 31.29,36.75 31.5,36.54 | R11.1 24.59,48.73 v25.4,47.92 | R12.1 29.67,48.12 v29.26,47.72 | R37.1 42.53,20.22 43.28,19.47 45.11,19.47 45.72,20.08 48.16,20.08 48.97,19.27 48.97,18.05 48.56,17.64 42.27,17.64 42.06,17.44 42.06,16.64 R9.1 | 41.82,33.9 43.48,33.9 | 43.48,33.9 44.7,32.68 44.91,32.68 45.31,31.87 | 45.31,31.87 v45.52,31.87 | v45.52,31.87 49.17,31.87 | 43.48,33.9 43.48,33.7 45.31,31.87 | 43.48,33.9 43.89,33.9 v45.52,31.87
  Top 0.508: U$1.A8 U$1.A9 U$1.A10 U$1.A11
  Bottom 0.203: v26.82,23.94 26.42,24.55 26.62,24.35 | v24.38,32.88 24.99,32.88 25.6,33.49 25.6,34.51 v28.24,37.15 | U$1.A11 18.52,5.02 17.07,6.47 17.48,6.47 18.08,7.08 18.08,6.88 17.68,6.47 | U$1.A12 U$1.A13 | U$1.A12 21.52,4.21 23.16,5.86 25.36,5.86 U$1.A18 U$1.A12 | R2.1 41.72,35.87 42.88,34.71 48.97,34.71 49.17,34.51 49.17,31.87 | 49.17,31.87 49.17,29.63 48.56,29.02 | v37.8,34.92 37.59,34.71 | v25.4,47.92 25.4,48.33 26.01,48.94 | v29.26,47.72 29.26,47.52 | v45.52,31.87 49.17,31.87
  Bottom 0.508: JP3.1 23.52,17.24 18.69,17.24 16.92,15.46 JP4.2 JP5.2 | 16.92,4.1 U$1.A9 | U$1.A8 U$1.A9 | U$1.A9 U$1.A11
  pour Bottom (isolate 0.508): 0.61,69.66 15.44,69.66 15.44,58.89 38.81,58.08 42.67,51.99 45.92,47.31 50.39,41.42 50.6,8.91 27.84,8.7 27.84,2.2 21.34,2.2 21.34,8.91 18.69,8.91 18.69,2.4 8.33,2.4 8.33,12.16 2.64,12.16 2.64,5.45 0.61,5.45
  pour Top (isolate 0.508): 1.22,69.26 15.65,69.26 15.65,59.1 38.61,58.08 43.08,51.38 45.92,47.31 50.39,41.22 50.6,40.61 50.6,8.91 27.64,8.91 27.64,1.79 21.34,1.79 21.34,8.91 18.49,8.91 18.49,2.2 8.13,2.2 8.13,12.16 2.64,12.16 2.64,5.25 1.02,5.25 1.02,5.86 1.63,5.86
LED_ERROR1
  Top 0.203: IC1.25 20.82,35.64 15.65,40.81 15.65,42.23 14.43,43.45 13.04,43.45 R15.2
LED_ERROR2
  Top 0.203: IC1.26 20.19,34.84 18.08,36.95 13.09,36.95 R16.2
LED_MOT_1
  Top 0.203: IC1.27 20.38,34.04 17.88,36.54 15.65,36.54 14.02,34.92 14.02,31.98 R17.2
LED_MOT_2
  Top 0.203: IC1.33 17.88,29.24 R18.2
LED_ORDERS
  Top 0.203: IC1.24 20.63,36.44 16.26,40.81 16.26,48.33 14.63,49.95 13.19,49.95 R14.2
LED_POWER
  Top 0.203: IC1.23 20.43,37.24 16.66,41.01 16.66,49.14 14.43,51.38 13.61,51.38 13.21,52.39 13.21,55.66 R13.2 12.28,56.05
MISO
  Top 0.203: OK6.8 R4.1 41.11,51.51 42.47,50.16 42.47,48.73 40.64,46.91 33.53,46.91 31.9,48.53 31.9,55.03 30.28,56.66 27.03,56.66 25.81,55.44 25.81,53 26.42,52.39 26.42,44.26 28.04,42.64 28.04,39.08 IC1.16
MOSI
  Top 0.203: OK5.3 27.13,44.77 28.85,43.04 28.85,39.07 IC1.15
MOT_CONTROL_A_1  (via drill 0.6)
  Top 0.203: IC1.13 30.48,40 33.53,43.04 | v39.62,36.34 40.23,36.34 40.64,36.75 40.64,41.42 39.01,43.04 33.53,43.04 | R1.1 33.59,43.11 33.53,43.04
  Bottom 0.203: 39.01,36.54 39.22,36.34 v39.62,36.34 40.64,34.92 41.66,34.92 42.06,34.31 42.06,32.68 42.27,32.48 42.88,32.48 43.42,31.93 44.03,31.93 Q2.1
MOT_CONTROL_A_2
  Top 0.203: IC1.7 35.22,34.04 36.17,33.09 37.66,33.09 R6.2 37.86,33.23 39.62,31.46 40.01,31.46 Q5.1
MOT_CONTROL_B_1  (via drill 0.6)
  Top 0.203: v30.07,43.65 30.07,41.01 29.67,40.61 29.67,39.05 IC1.14
  Bottom 0.203: Q4.1 11.56,60.84 R3.1 12.87,61.67 20.32,54.22 20.32,50.16 26.82,43.65 v30.07,43.65
MOT_CONTROL_B_2  (via drill 0.6)
  Top 0.203: IC1.5 34.99,32.44 40.03,27.4 | R7.2 41.72,25.37 42.06,25.37 40.03,27.4 | 40.03,27.4 v40.44,27.8
  Bottom 0.203: v40.44,27.8 41.81,27.8 Q6.1
MOT_CONTROL_EN_1  (via drill 0.6)
  Top 0.203: IC1.21 24.08,42.13 v23.98,42.23 23.71,42.23 R33.1
  Bottom 0.203: v23.98,42.23 28.45,42.23 29.26,41.42 30.28,41.42 32.51,43.65 40.86,43.65 Q1.1
MOT_CONTROL_EN_2
  Top 0.203: IC1.20 24.88,43.97 21.74,47.11 21.27,47.11 | 21.27,47.11 R5.2 | 21.27,47.11 21.13,47.11 16.66,51.58 16.66,55.64 12.6,59.71 12.6,60.37 Q3.1
N$1
  Top 0.508: 59.13,64.38 59.13,56.3 IC2.14
  Top 0.61: MOTOR_2_OUT.1 56.64,67.07 58.93,64.79 59.13,64.38
N$2
  Bottom 0.203: Q1.2 44.18,36.79 R2.2
N$3
  Top 0.61: MOTOR_2_OUT.2 53.14,66.93 51.61,65.19 51.61,58.49 52.22,57.88 52.63,57.88 52.83,57.68 52.83,54.68 IC2.11
N$4
  Bottom 0.203: Q1.3 46.69,39.39 OK1.2
N$5
  Bottom 0.203: R34.2 40.57,32.93 Q2.2
N$6
  Bottom 0.203: Q2.3 47.41,33.58 OK1.4
N$7  (1 unrouted)
  Bottom 0.203: Q4.2 7.58,58.83 8.33,58.08
N$8
  Top 0.203: R9.2 OK4.2
N$9
  Top 0.203: Q3.3 OK2.4
N$10
  Top 0.203: Q5.3 43.4,31.95 44.7,30.65 44.7,29.43 46.13,28.01 47.4,28.01 OK3.2
N$11
  Top 0.203: Q5.2 43.62,22.99 44.7,21.91 44.7,20.96 R37.2
N$12
  Top 0.203: R10.2 OK4.4
N$13
  Top 0.203: R11.2 OK5.2
N$14
  Top 0.203: R12.2 OK5.4
N$15
  Top 0.203: Q3.2 14.56,60.79 13.82,61.54 11.58,61.54 10.97,60.93 10.97,60.52 9.55,59.1 7.25,59.1 R35.2
N$16
  Top 0.203: R13.1 LED_POWER.A
N$17
  Top 0.203: R14.1 LED_ORDERS.A
N$18
  Bottom 0.203: Q4.3 OK2.2
N$19
  Top 0.203: R31.1 OK4.6
  Bottom 0.203: SLAVE_SELECT_2.1 69.7,59.1 72.54,56.25 72.54,27.6 72.95,26.59 72.95,10.13 72.54,9.31 62.59,9.31 61.37,9.11 57.71,9.11 56.69,9.72 54.66,9.72 53.24,11.14 53.24,11.85 OK4.6 56.69,13.83
N$20
  Top 0.203: R15.1 LED_ERROR1.A
N$21
  Top 0.203: R16.1 LED_ERROR2.A
N$22
  Top 0.203: R17.1 LED_MOT1.A
N$23
  Top 0.203: R18.1 LED_MOT2.A
N$24  (via drill 0.6)
  Top 0.203: OK1.8 R21.2 58.32,41.28 58.32,42.44 64.41,48.53 64.41,56.25 65.48,57.32 IC2.1 | LED2.A 37.02,67.47 v38.61,69.05
  Bottom 0.203: v38.61,69.05 41.86,69.05 43.48,70.68 43.48,72.71 42.88,73.32 42.88,75.76 44.09,76.98 64.82,76.98 66.45,75.15 66.24,63.01 IC2.1
N$25
  Top 0.203: R19.1 OK1.6 53.85,37.3 53.85,42.44 61.77,50.36 61.77,56.66 62.94,57.83 IC2.2
N$26
  Top 0.203: R25.1 32.75,66.16 LED2.C
N$27  (via drill 0.6)
  Top 0.203: v29.67,68.24 30.21,68.24 LED1.C
  Bottom 0.203: R26.1 21.59,75.4 24.38,77.18 25.4,77.18 26.21,76.37 26.21,71.7 v29.67,68.24
N$28  (via drill 0.6)
  Top 0.203: OK2.6 11.07,75.45 9.55,76.98 2.44,76.98 2.03,76.37 1.83,71.7 3.05,71.09 17.48,71.09 20.32,68.44 20.32,61.74 21.13,60.93 30.48,60.72 v31.29,60.72 31.09,62.35 31.09,65.87 LED1.A | R20.1 47.6,54.53 IC2.9
  Bottom 0.203: IC2.9 46.13,54.63 40.03,60.72 v31.29,60.72
N$29
  Top 0.203: R22.1 3.34,74.29 OK2.8 6.15,74.29 7.52,72.92 8.53,72.51 9.14,72.1 12.4,72.1 13.21,72.92 20.52,72.92 23.98,76.37 30.68,76.37 33.93,79.21 47.14,79.21 50.19,76.98 50.19,62.3 IC2.7
N$30  (via drill 0.6)
  Top 0.203: R24.1 OK3.8 | IC2.15 62.94,49.5 v56.29,42.84
  Bottom 0.203: OK3.8 55.12,30.24 53.85,30.24 52.22,31.06 52.22,42.23 52.83,42.84 v56.29,42.84
N$31
  Top 0.61: IC2.3 60.4,70.74 MOTOR_1_OUT.2
N$32
  Top 0.61: IC2.6 52.78,65.14 54.05,66.41 54.05,72.71 54.86,73.52 54.86,76.78 55.47,77.39 58.67,77.39 MOTOR_1_OUT.1
N$33
  Top 0.203: R23.1 OK3.6 53.75,25.26 52.22,26.79 52.22,46.09 50.39,47.92 50.39,53.46 IC2.10
N$34
  Top 0.203: R28.2 OK6.1
N$35
  Bottom 0.203: OK6.3 35.51,63.82 27.43,71.9 27.43,74.39 OPTO_IN.1
N$36
  Bottom 0.203: OK6.4 32.97,63.72 24.79,71.9 24.79,74.39 OPTO_IN.2
N$37
  Top 0.203: LED3.C 41.25,73.44 R32.1
N$38
  Bottom 0.203: Q6.2 44.64,28.41 R38.2
N$41  (1 unrouted)
  Bottom 0.203: Q6.3 44.58,24.67 45.72,23.54 46.74,23.54 47.55,22.72
N$42
  Top 0.203: JP6.2 28.65,15.82 26.82,17.64 26.82,22.72 25.6,23.94 25.6,27.36 IC1.37
OPTIONAL_OPTO_IN  (via drill 0.6)
  Top 0.203: OK6.6 R8.1 34.27,51.51 v33.32,50.56 | v23.16,23.74 23.57,23.74 24.79,24.96 24.79,27.35 IC1.36
  Bottom 0.203: v33.32,50.56 33.32,45.48 30.07,42.23 29.46,42.23 28.45,43.25 20.32,43.25 18.29,41.22 18.29,36.34 19.71,34.92 19.71,27.2 v23.16,23.74
PDI_CLK
  Top 0.203: JP3.2 24.74,16.48 23.57,17.64 23.57,18.86 22.56,19.88 21.54,19.88 21.13,20.29 21.13,24.55 22.76,26.18 23.77,26.18 24.18,26.59 24.18,27.34 IC1.35
PDI_DATA
  Top 0.203: JP3.6 19.66,16.17 20.73,17.24 20.73,24.89 IC1.34
SCK
  Top 0.203: OK5.1 22.45,48.02 27.23,42.64 27.23,39.09 IC1.17
SCL1  (via drill 0.6)
  Top 0.203: IC1.29 19.34,32.44 18.08,33.7 16.92,33.7 I2C1.1 | U$1.A3 v10.52,9.11 10.52,9.72 10.52,11.91 13.21,14.6 13.21,19.07 12.19,20.08 6.3,20.08 v5.89,20.49
  Bottom 0.203: I2C1.1 16.71,33.9 15.85,33.9 14.83,32.88 14.83,30.04 12.6,27.8 8.13,27.8 5.28,24.55 5.28,23.33 5.89,22.32 v5.89,20.49 | U$1.A3 v10.52,9.11
SCL2  (via drill 0.6)
  Top 0.203: IC1.11 35.09,37.24 I2C2.1 | v12.6,8.91 12.52,8.83 U$1.A5
  Bottom 0.203: 12.52,9.11 U$1.A5 12.52,8.83 v12.6,8.91 | 12.52,9.11 12.52,10.66 15.65,13.78 35.97,13.78 36.37,13.38 38.4,13.38 39.83,14.8 39.83,22.52 35.76,26.59 35.76,37.91 I2C2.1 | 12.4,9.23 12.52,9.11
SDA1  (via drill 0.6)
  Top 0.203: U$1.A4 v11.52,7.69 11.52,8.3 11.52,12.3 13.82,14.6 13.82,19.27 12.19,20.9 6.71,20.9 5.28,23.13 5.28,24.55 8.13,27.8 12.6,27.8 15.85,31.06 16.66,31.06 16.81,31.21 I2C1.2 15.24,31.26 14.43,32.07 14.43,34.71 15.65,35.93 17.68,35.93 20.37,33.24 IC1.28
  Bottom 0.203: U$1.A4 v11.52,7.69
SDA2  (via drill 0.6)  (2 unrouted)
  Top 0.203: IC1.10 36.83,36.44 I2C2.2 | v15.65,12.16 37.19,12.16 40.03,14.8 40.03,20.29 39.01,20.9 39.01,24.96 v36.78,27.2 | U$1.A6 13.52,9.83 v13.82,10.13
  Bottom 0.203: U$1.A6 13.52,9.72 13.52,10.03 v15.65,12.16 | v36.78,27.2 36.78,36.39 I2C2.2 | 15.65,11.96 15.65,11.85
SS1
  Top 0.203: IC1.3 35.17,30.84 39.62,26.38 39.62,21.5 40.64,20.49 40.64,14.8 41.66,13.78 47.55,13.78 OK4.3
SS2
  Top 0.203: IC1.4 34.98,31.64 40.03,26.59 40.03,21.71 42.88,18.86 47.55,18.86 OK4.1
(copper drawn outside any net)
  shapes: Bottom area x1